# Altium schematic sheet Sheet_1_2025-08-11.schdoc
size 286 x 207 mm
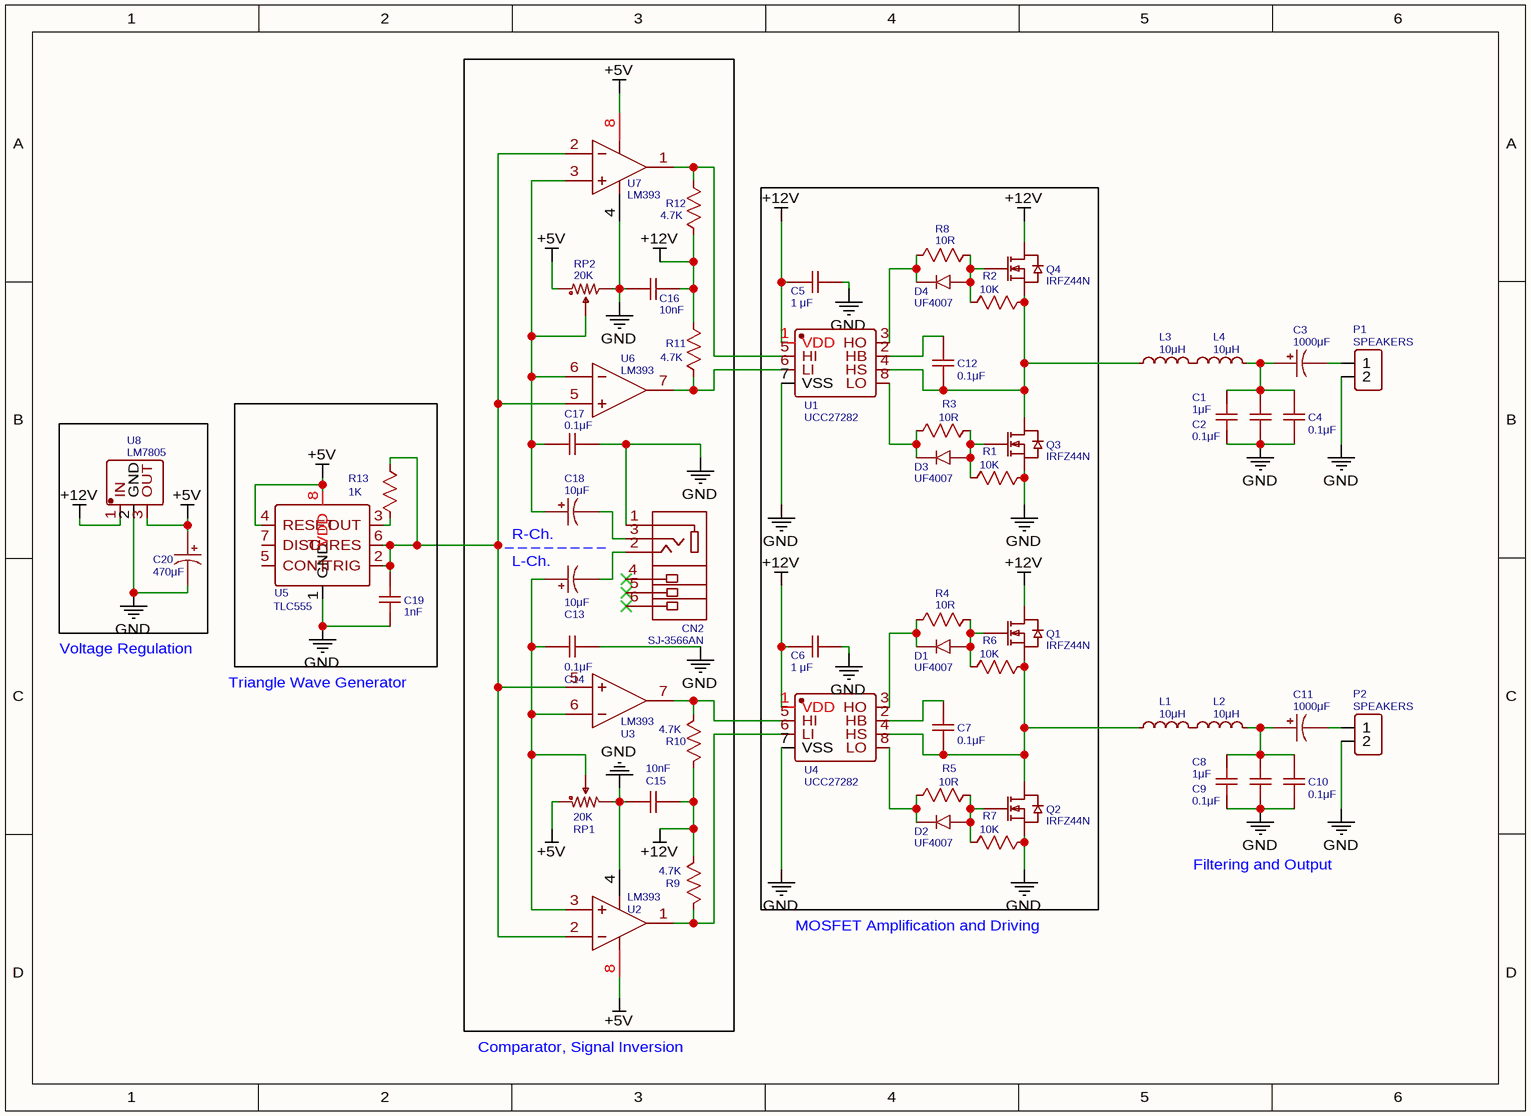
[diagram p0: Sheet_1_2025-08-11.schdoc]

## Parts
C1  1μF  [RAD-0.1]
C2  0.1μF  [RAD-0.1]
C3  1000μF  [CAP-D10.0×F5.0]
C4  0.1μF  [RAD-0.1]
C5  1 μF  [RAD-0.1]
C6  1 μF  [RAD-0.1]
C7  0.1μF  [RAD-0.1]
C8  1μF  [RAD-0.1]
C9  0.1μF  [RAD-0.1]
C10  0.1μF  [RAD-0.1]
C11  1000μF  [CAP-D10.0×F5.0]
C12  0.1μF  [RAD-0.1]
C13  10μF  [CAP-D8.0×F3.5]
C14  0.1μF  [RAD-0.1]
C15  10nF  [RAD-0.1]
C16  10nF  [RAD-0.1]
C17  0.1μF  [RAD-0.1]
C18  10μF  [CAP-D8.0×F3.5]
C19  1nF  [RAD-0.1]
C20  470μF  [CAP-D8.0×F3.5]
CN2  SJ-3566AN  [AUDIO-TH_SJ-3566AN_1]
D1  UF4007  [DO-41_BD2.4-L4.7-P8.70-D0.9-FD]
D2  UF4007  [DO-41_BD2.4-L4.7-P8.70-D0.9-FD]
D3  UF4007  [DO-41_BD2.4-L4.7-P8.70-D0.9-FD]
D4  UF4007  [DO-41_BD2.4-L4.7-P8.70-D0.9-FD]
L1  10μH  [L_AXIAL-0.6]
L2  10μH  [L_AXIAL-0.6]
L3  10μH  [L_AXIAL-0.6]
L4  10μH  [L_AXIAL-0.6]
P1  SPEAKERS  [CONN-TH_2P-P5.00]
P2  SPEAKERS  [CONN-TH_2P-P5.00]
Q1  IRFZ44N  [TO-220-3_L10.0-W4.5-P2.54-L]
Q2  IRFZ44N  [TO-220-3_L10.0-W4.5-P2.54-L]
Q3  IRFZ44N  [TO-220-3_L10.0-W4.5-P2.54-L]
Q4  IRFZ44N  [TO-220-3_L10.0-W4.5-P2.54-L]
R1  10K  [R_AXIAL-0.4]
R2  10K  [R_AXIAL-0.4]
R3  10R  [R_AXIAL-0.4]
R4  10R  [R_AXIAL-0.4]
R5  10R  [R_AXIAL-0.4]
R6  10K  [R_AXIAL-0.4]
R7  10K  [R_AXIAL-0.4]
R8  10R  [R_AXIAL-0.4]
R9  4.7K  [R_AXIAL-0.4]
R10  4.7K  [R_AXIAL-0.4]
R11  4.7K  [R_AXIAL-0.4]
R12  4.7K  [R_AXIAL-0.4]
R13  1K  [R_AXIAL-0.4]
RP1  20K  [RES-ADJ-TH_3386P]
RP2  20K  [RES-ADJ-TH_3386P]
U1  UCC27282  [SOIC-DIP ADAPTER]
U2  LM393  [DIP-8_L10.1-W6.3-P2.54-LS7.6-BL-1]
U3  LM393  [DIP-8_L10.1-W6.3-P2.54-LS7.6-BL-1]
U4  UCC27282  [SOIC-DIP ADAPTER]
U5  TLC555  [DIP-8_L9.7-W6.4-P2.54-LS7.6-BL]
U6  LM393  [DIP-8_L10.1-W6.3-P2.54-LS7.6-BL-1]
U7  LM393  [DIP-8_L10.1-W6.3-P2.54-LS7.6-BL-1]
U8  LM7805  [TO-220-3_L10.0-W4.5-P2.54-L]

## Nets
+5V: C20.1 RP1.1 RP2.1 U2.8(VCC) U5.4(RESET) U5.8(VDD) U7.8(VCC) U8.3(OUT)
+12V: C5.1 C6.1 C15.1 C16.1 Q1.2(D) Q4.2(D) R9.2 R10.1 R11.1 R12.2 U1.1(VDD) U4.1(VDD) U8.1(IN)
GND: C1.2 C2.2 C4.1 C5.2 C6.2 C8.2 C9.2 C10.1 C14.1 C15.2 C16.2 C17.1 C19.1 C20.2 CN2.1 P1.2 P2.2 Q2.3(S) Q3.3(S) R1.2 R7.2 RP1.3 RP2.3 U1.7(VSS) U2.4(GND) U4.7(VSS) U5.1(GND) U7.4(GND) U8.2(GND)
NetC1_1: C1.1 C2.1 C3.1 C4.2 L4.2
NetC3_2: C3.2 P1.1
NetC7_1: C7.1 L1.1 Q1.3(S) Q2.2(D) R6.2 U4.4(HS)
NetC7_2: C7.2 U4.2(HB)
NetC8_1: C8.1 C9.1 C10.2 C11.1 L2.2
NetC11_2: C11.2 P2.1
NetC12_1: C12.1 L3.1 Q3.2(D) Q4.3(S) R2.2 U1.4(HS)
NetC12_2: C12.2 U1.2(HB)
NetC13_1: C13.1 C14.2 RP1.2 U2.3(1IN+) U3.6(2IN-)
NetC13_2: C13.2 CN2.2
NetC17_2: C17.2 C18.1 RP2.2 U6.6(2IN-) U7.3(1IN+)
NetC18_2: C18.2 CN2.3
NetC19_2: C19.2 R13.2 U2.2(1IN-) U3.5(2IN+) U5.2(TRIG) U5.6(THRES) U6.5(2IN+) U7.2(1IN-)
NetD1_1: D1.1(A) Q1.1(G) R4.1 R6.1
NetD1_2: D1.2(C) R4.2 U4.3(HO)
NetD2_1: D2.1(A) Q2.1(G) R5.1 R7.1
NetD2_2: D2.2(C) R5.2 U4.8(LO)
NetD3_1: D3.1(A) Q3.1(G) R1.1 R3.1
NetD3_2: D3.2(C) R3.2 U1.8(LO)
NetD4_1: D4.1(A) Q4.1(G) R2.1 R8.1
NetD4_2: D4.2(C) R8.2 U1.3(HO)
NetL1_2: L1.2 L2.1
NetL3_2: L3.2 L4.1
NetR9_1: R9.1 U2.1(1OUT) U4.6(LI)
NetR10_2: R10.2 U3.7(2OUT) U4.5(HI)
NetR11_2: R11.2 U1.6(LI) U6.7(2OUT)
NetR12_1: R12.1 U1.5(HI) U7.1(1OUT)
NetR13_1: R13.1 U5.3(OUT)

Not connected (* = marked no-connect by the designer): CN2 4 5* 6*; U5 5(CONT) 7(DISC)

## Notes on the sheet
- _ _ _ _ _ _ _ _
- (near C13) L-Ch.
- R-Ch.
- Voltage Regulation
- Triangle Wave Generator
- Filtering and Output
- MOSFET Amplification and Driving
- Comparator, Signal Inversion

## Library data of the parts
C1 C8 = 1μF: nameAlias: Value(F); Contributor: LCEDA_Lib; spicePre: C; spiceSymbolName: C_RAD-0.1_US
C2 C4 C7 C9 C10 C12 C14 C17 = 0.1μF: nameAlias: Value(F); Contributor: LCEDA_Lib; spicePre: C; spiceSymbolName: C_RAD-0.1_US
C3 C11 = 1000μF: nameAlias: Value(F); Contributor: LCEDA_Lib; spicePre: C; spiceSymbolName: CE_TH_D10.0×F5.0_US
C5 C6 = 1 μF: nameAlias: Value(F); Contributor: LCEDA_Lib; spicePre: C; spiceSymbolName: C_RAD-0.1_US
C13 C18 = 10μF: nameAlias: Value(F); Contributor: LCEDA_Lib; spicePre: C; spiceSymbolName: CE_TH_D8.0×F3.5_US
C15 C16 = 10nF: nameAlias: Value(F); Contributor: LCEDA_Lib; spicePre: C; spiceSymbolName: C_RAD-0.1_US
C19 = 1nF: nameAlias: Value(F); Contributor: LCEDA_Lib; spicePre: C; spiceSymbolName: C_RAD-0.1_US
C20 = 470μF: nameAlias: Value(F); Contributor: LCEDA_Lib; spicePre: C; spiceSymbolName: CE_TH_D8.0×F3.5_US
CN2 = SJ-3566AN: Manufacturer: CUI; Contributor: lcsc; Supplier: LCSC; Supplier Part: C5370059; Manufacturer Part: SJ-3566AN; JLCPCB Part Class: Extended Part; spicePre: C; spiceSymbolName: SJ-3566AN
D1-D4 = UF4007: Manufacturer: STARSEA; Contributor: 立创EDA官方封装库; Supplier: LCSC; Manufacturer Part: UF4007; Supplier Part: C84067; JLCPCB Part Class: Extended Part; spicePre: D; spiceSymbolName: UF4007_C84067
L1-L4 = 10μH: nameAlias: Value(H); Contributor: LCEDA_Lib; spicePre: L; spiceSymbolName: L_AXIAL-0.6_US
P1 P2 = SPEAKERS: Contributor: LCEDA_Lib; Supplier: LCSC; spicePre: P; spiceSymbolName: CONN-TH_2P-P5.00
Q1-Q4 = IRFZ44N: Manufacturer: IR; Manufacturer Part: IRFZ44NPBF; Supplier: LCSC; Supplier Part: C2586; JLCPCB Part Class: Extended Part; spicePre: Q; spiceSymbolName: IRFZ44NPBF
R1 R2 R6 R7 = 10K: nameAlias: Value(Ω); Contributor: LCEDA_Lib; spicePre: R; spiceSymbolName: R_AXIAL-0.4_US
R3-R5 R8 = 10R: nameAlias: Value(Ω); Contributor: LCEDA_Lib; spicePre: R; spiceSymbolName: R_AXIAL-0.4_US
R9-R12 = 4.7K: nameAlias: Value(Ω); Contributor: LCEDA_Lib; spicePre: R; spiceSymbolName: R_AXIAL-0.4_US
R13 = 1K: nameAlias: Value(Ω); Contributor: LCEDA_Lib; spicePre: R; spiceSymbolName: R_AXIAL-0.4_US
RP1 RP2 = 20K: nameAlias: Value; Contributor: LCEDA_Lib; value(Ω): 10K; Supplier: LCSC; spicePre: R; spiceSymbolName: R_3386P_US
U1 U4 = UCC27282: Manufacturer: Texas Instruments; Manufacturer Part: UCC27200DR; Contributor: Electric_Evan; Supplier: Digi-Key; Supplier Part: 296-41795; JLCPCB Part Class: Extended Part; link: https://www.ti.com/lit/ds/symlink/ucc27200.pdf; spicePre: U; spiceSymbolName: UCC27200DR
U2 U3 U6 U7 = LM393: Manufacturer: TI; Manufacturer Part: LM393P; subpart_no: 1; spicePre: X; Supplier: LCSC; Supplier Part: C5209; JLCPCB Part Class: Extended Part; spiceSymbolName: LM393P
U5 = TLC555: Manufacturer: TI(德州仪器); Manufacturer Part: TLC555CP; Contributor: Electric_Evan; Supplier: LCSC; Supplier Part: C910886; link: https://www.ti.com/lit/ds/symlink/tlc555.pdf; spicePre: U; spiceSymbolName: TLC555CP
U8 = LM7805: Manufacturer: FAIRCHILD; Manufacturer Part: LM7805CT; Supplier: LCSC; Supplier Part: C22146; JLCPCB Part Class: Extended Part; spicePre: U; spiceSymbolName: LM7805CT